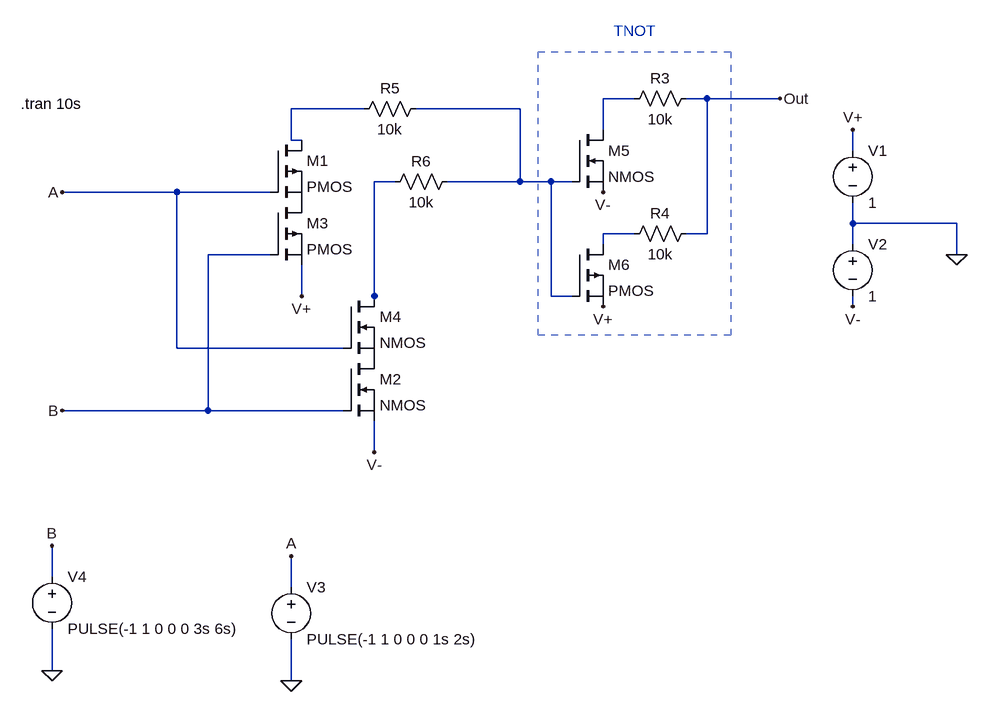
[diagram p0: schematic TAND.asc]
TAND.asc, the LTspice schematic file:
Version 4
SHEET 1 1456 680
WIRE 256 -464 208 -464
WIRE 368 -464 336 -464
WIRE 480 -464 368 -464
WIRE -160 -448 -272 -448
WIRE 80 -448 -80 -448
WIRE 208 -416 208 -464
WIRE -272 -400 -272 -448
WIRE -256 -400 -272 -400
WIRE 592 -384 592 -416
WIRE -112 -336 -144 -336
WIRE 80 -336 80 -448
WIRE 80 -336 -32 -336
WIRE 128 -336 80 -336
WIRE 160 -336 128 -336
WIRE -448 -320 -624 -320
WIRE -304 -320 -448 -320
WIRE 592 -272 592 -304
WIRE 752 -272 592 -272
WIRE 256 -256 208 -256
WIRE 368 -256 368 -464
WIRE 368 -256 336 -256
WIRE 208 -240 208 -256
WIRE 592 -240 592 -272
WIRE -304 -224 -400 -224
WIRE 752 -224 752 -272
WIRE -256 -160 -256 -208
WIRE -144 -160 -144 -336
WIRE 128 -160 128 -336
WIRE 160 -160 128 -160
WIRE -144 -144 -144 -160
WIRE 592 -144 592 -160
WIRE -448 -80 -448 -320
WIRE -192 -80 -448 -80
WIRE -400 16 -400 -224
WIRE -400 16 -624 16
WIRE -192 16 -400 16
WIRE -144 80 -144 32
WIRE -640 272 -640 224
WIRE -272 288 -272 240
WIRE -640 416 -640 352
WIRE -272 432 -272 368
FLAG 752 -224 0
FLAG 592 -416 V+
FLAG 592 -144 V-
FLAG -144 80 V-
FLAG -624 -320 A
FLAG -272 432 0
FLAG -272 240 A
FLAG -624 16 B
FLAG -640 416 0
FLAG -640 224 B
FLAG -256 -160 V+
FLAG 208 -320 V-
FLAG 480 -464 Out
FLAG 208 -144 V+
SYMBOL pmos -304 -400 R0
SYMATTR InstName M1
SYMBOL Voltage 592 -400 R0
SYMATTR InstName V1
SYMATTR Value 1
SYMBOL voltage 592 -256 R0
SYMATTR InstName V2
SYMATTR Value 1
SYMBOL nmos -192 -64 R0
SYMATTR InstName M2
SYMBOL voltage -272 272 R0
SYMATTR InstName V3
SYMATTR Value PULSE(-1 1 0 0 0 1s 2s)
SYMBOL pmos -304 -304 R0
SYMATTR InstName M3
SYMBOL voltage -640 256 R0
SYMATTR InstName V4
SYMATTR Value PULSE(-1 1 0 0 0 3s 6s)
SYMBOL nmos -192 -160 R0
SYMATTR InstName M4
SYMBOL nmos 160 -416 R0
SYMATTR InstName M5
SYMBOL Res 352 -480 R90
WINDOW 0 0 56 VBottom 2
WINDOW 3 32 56 VTop 2
SYMATTR InstName R3
SYMATTR Value 10k
SYMBOL pmos 160 -240 R0
SYMATTR InstName M6
SYMBOL Res 352 -272 R90
WINDOW 0 0 56 VBottom 2
WINDOW 3 32 56 VTop 2
SYMATTR InstName R4
SYMATTR Value 10k
SYMBOL Res -64 -464 R90
WINDOW 0 0 56 VBottom 2
WINDOW 3 32 56 VTop 2
SYMATTR InstName R5
SYMATTR Value 10k
SYMBOL Res -16 -352 R90
WINDOW 0 0 56 VBottom 2
WINDOW 3 32 56 VTop 2
SYMATTR InstName R6
SYMATTR Value 10k
TEXT -688 -456 Left 2 !.tran 10s
TEXT 224 -568 Left 2 ;TNOT
RECTANGLE Normal 108 -536 404 -100 2

The netlist it stands for:
* TAND.asc
M1 N002 A P001 P001 PMOS
V1 V+ 0 1
V2 0 V- 1
M2 P002 B V- V- NMOS
V3 A 0 PULSE(-1 1 0 0 0 1s 2s)
M3 P001 B V+ V+ PMOS
V4 B 0 PULSE(-1 1 0 0 0 3s 6s)
M4 N004 A P002 P002 NMOS
M5 N001 N003 V- V- NMOS
R3 Out N001 10k
M6 N005 N003 V+ V+ PMOS
R4 Out N005 10k
R5 N003 N002 10k
R6 N003 N004 10k
.model NMOS NMOS
.model PMOS PMOS
.lib standard.mos
.tran 10s
* TNOT
.backanno
.end